# Altium project Systolic.PrjPcb
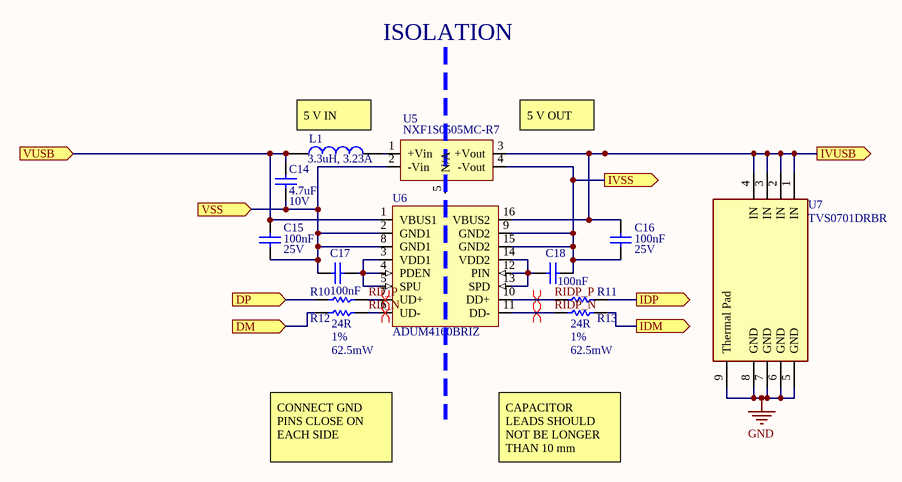
[diagram p0: USB Isolation.SchDoc]
3 sheets, 41 parts. Net scope: flat (ports and power ports of the same name join across sheets).
Board file: Systolic.PcbDoc
Sheets:
  USB Isolation.SchDoc
  ECG FRONT.SchDoc
  LDOSUPPLY.SchDoc

## Sheet USB Isolation.SchDoc
size A

### Parts
C14  value 4.7uF  Voltage Rating: 10V  [0603 CAPACITOR]  (hidden comment: LMK107BJ475KA-T)
C15  value 100nF  Voltage Rating: 25V  [0603 CAPACITOR]  (hidden comment: CGA3E2X7R1E104K080AA)
C16  value 100nF  Voltage Rating: 25V  [0603 CAPACITOR]  (hidden comment: CGA3E2X7R1E104K080AA)
C17  value 100nF  [0603 CAPACITOR]  (hidden comment: CGA3E2X7R1E104K080AA)
C18  value 100nF  [0603 CAPACITOR]  (hidden comment: CGA3E2X7R1E104K080AA)
L1  3.3uH, 3.23A  [WE-LQS_4025]
R10  MCMR04X24R0FTL  [0402 RESISTOR]  (value not drawn)
R11  MCMR04X24R0FTL  [0402 RESISTOR]  (value not drawn)
R12  Resistance: 24R  Tolerance: 1%  Power Rating: 62.5mW  [0402 RESISTOR]  (hidden comment: MCMR04X24R0FTL)
R13  Resistance: 24R  Tolerance: 1%  Power Rating: 62.5mW  [0402 RESISTOR]  (hidden comment: MCMR04X24R0FTL)
U5  NXF1S0505MC-R7  [QFN254P1524X1067X501-6N]
U6  ADUM4160BRIZ  [SOIC127P1030X265-16N]
U7  TVS0701DRBR  [FP-DRB0008A-MFG]

### Ports
DM (in), DP (in), IDM (out), IDP (out), IVSS (out), IVUSB (out), VSS (in), VUSB (in)

### Nets
GND: U7.5(GND) U7.6(GND) U7.7(GND) U7.8(GND) U7.9(Thermal_Pad)
RD_N: R12.2 U6.6(UD-)
RD_P: R10.2 U6.7(UD+)
RIDP_N: R13.1 U6.11(DD-)
RIDP_P: R11.1 U6.10(DD+)
NetC14_1: C14.1 C15.1 C17.2 U5.2(-Vin) U6.2(GND1) U6.8(GND1) ; port VSS
NetC14_2: C14.2 C15.2 L1.1 U6.1(VBUS1) ; port VUSB
NetC16_1: C16.1 C18.1 U5.4(-Vout) U6.9(GND2) U6.15(GND2) ; port IVSS
NetC16_2: C16.2 U5.3(+Vout) U6.16(VBUS2) U7.1(IN) U7.2(IN) U7.3(IN) U7.4(IN) ; port IVUSB
NetC17_1: C17.1 U6.3(VDD1) U6.4(PDEN) U6.5(SPU)
NetC18_2: C18.2 U6.12(PIN) U6.13(SPD) U6.14(VDD2)
NetL1_2: L1.2 U5.1(+Vin)
NetR10_1: R10.1 ; port DP
NetR11_2: R11.2 ; port IDP
NetR12_1: R12.1 ; port DM
NetR13_2: R13.2 ; port IDM

Not connected (* = marked no-connect by the designer): U5 5(N/A)

### Layout directives
differential pair; differential pair class USB: RD_N, RD_P, RIDP_N, RIDP_P

### Notes on the sheet
- ISOLATION
- 5 V IN
- (near U5) 5 V OUT
- CONNECT GND PINS CLOSE ON EACH SIDE
- CAPACITOR LEADS SHOULD NOT BE LONGER THAN 10 mm

### Library data of the parts
C14 = CMP-001-00085-5: Cap Ceramic 4.7uF 10V X5R 10% SMD 0603 85°C; Case Code (Imperial): 0603; Number of Pins: 2; Dielectric: X5R; Dielectric Material: Ceramic; Contact Plating: Nickel; REACH SVHC: Unknown; Package Quantity: 1; Width: 0.031inch; Lead Free: Lead Free; Min Operating Temperature: -55°C; Packaging: Tape and Reel; Height: 0.8mm; Case Code (Metric): 1608; Length: 1.6mm; Tolerance: 10%; Case/Package: 0603; Max Operating Temperature: 85°C; Radiation Hardening: No; Mount: Surface Mount; Voltage Rating (DC): 10V; Depth: 0.8mm; Halogen Free: Halogen Free; Termination: SMD/SMT; Thickness: 0.035inch
C15-C18 = CMP-001-00083-5: Cap Ceramic 0.1uF 25V X7R 10% SMD 0603 125°C; Max Operating Temperature: 125°C; Mount: Surface Mount; Thickness: 0.035inch; Composition: Ceramic; Lead Free: Lead Free; Case/Package: 0603; Packaging: Tape and Reel; Ratings: AEC-Q200; Min Operating Temperature: -55°C; Weight: 7.1E-05oz; Width: 0.031inch; Termination: SMD/SMT; Tolerance: 10%; Package Quantity: 1; REACH SVHC: No SVHC; Dielectric: X7R; Voltage Rating (DC): 25V; Case Code (Imperial): 0603; Height: 0.8mm; Case Code (Metric): 1608; Depth: 0.8mm; Length: 1.6mm
  C17 C18: Voltage Rating: 25V
L1 = 74404043033A: WE-LQS SMT Power Inductor, size 4025, 3.3uH, 3.23A; Manufacturer: Wurth Elektronik; Saturation Current: 1.75A; Self Resonant Frequency: 75MHz; DC Resistance: 33mOhm; ComponentLink1Description: Manufacturer; ComponentLink1URL: http://www.we-online.de; ComponentLink2Description: Datasheet; ComponentLink2URL: https://www.we-online.com/catalog/datasheet/74404043033A.pdf; Published Date: May 2020; Rated Current: 3.23A; Operating Temperature: -40 to +125degC; Mounting Technology: SMT; Packaging: Tape and Reel; Manufacturer Part Number: 74404043033A; Inductance: 3.3uH; Size: 4025
R10 R11 = CMP-009-00178-9: MULTICOMP - MCMR04X24R0FTL - RES, CERAMIC 24R, 1%, 0.063W, 0402; Power Rating: 62.5mW; Voltage Rating (DC): 50V; Temperature Coefficient: 100ppm/°C; Resistance: 24R; Tolerance: 1%; REACH SVHC: No SVHC; Case/Package: 0402; Packaging: Cut Tape; Voltage Rating: 50V; Case Code (Metric): 1005; Composition: Ceramic; Case Code (Imperial): 0402
R12 R13 = CMP-009-00178-9: MULTICOMP - MCMR04X24R0FTL - RES, CERAMIC 24R, 1%, 0.063W, 0402; Voltage Rating (DC): 50V; Temperature Coefficient: 100ppm/°C; REACH SVHC: No SVHC; Case/Package: 0402; Packaging: Cut Tape; Voltage Rating: 50V; Case Code (Metric): 1005; Composition: Ceramic; Case Code (Imperial): 0402
U5 = CMP-019-00050-4: Module Dc-dc 5 Vin 1-OUT 5V 0.2A 1W 5-PIN SMD T/r
U6 = CMP-019-00049-3: ANALOG DEVICES   ADUM4160BRIZ   Digital Isolator, 1, 60 ns, 3.1 V, 5.5 V, SOIC, 16 Pins; Isolated Power: No; Number of Channels: 2; Min Supply Voltage: 3.1V; Propagation Delay: 70ns; Max Supply Voltage: 5.5V; Rise Time: 20ns; Channel Type: Bidirectional; Nominal Supply Current: 6mA; Data Rate: 12Mbps; Max Input Current: 8mA; Turn-On Delay Time: 60ns; Depth: 2.65mm; Contact Plating: Tin,Matte; REACH SVHC: No SVHC; Min Operating Temperature: -40°C; Lead Free: Contains Lead; Number of Pins: 16; Packaging: Rail/Tube; Case/Package: SOIC; Length: 10.5mm; Package Quantity: 37; Max Operating Temperature: 105°C; Width: 7.6mm
U7 = CMP-04985-000001-1: TVS ARRAYS; Manufacturer: Texas instruments; Capacitance: 77pF; Peak Pulse Current: 30A; Standoff Height: 0mm; Direction: Bidirectional; Number Of Channels: 1; Breakdown Voltage: 9.3V; Reverse Standoff Voltage: 7V; Value: 77pF; Clamping Voltage: 11V; Temperature Range Low: -40°C; Category: IC; Lead Free: Yes; Device Class L2: ESD and Circuit Protection ICs; Ambient Temperature Range High: +125°C; RoHS: TRUE; Manufacturer Part Number: TVS0701DRBR; Device Class L3: unset; Ambient Temperature Range Low: -40°C; Mouser Description: 7-V bidirectional flat-clamp surge protection device 8-SON -40 to 125; Height: 1mm; Octopart: https://octopart.com/tvs0701drbr-texas+instruments-96189204; Automotive: No; Temperature: -40°C to +125°C; ComponentLink2URL: http://www.ti.com/lit/ds/symlink/tvs0701.pdf; Device Class L1: Circuit Protection; Package: DRB0008A; Digikey Description: TVS ARRAYS; Temperature Range High: +125°C; ComponentLink2Description: Datasheet

## Sheet ECG FRONT.SchDoc
size A
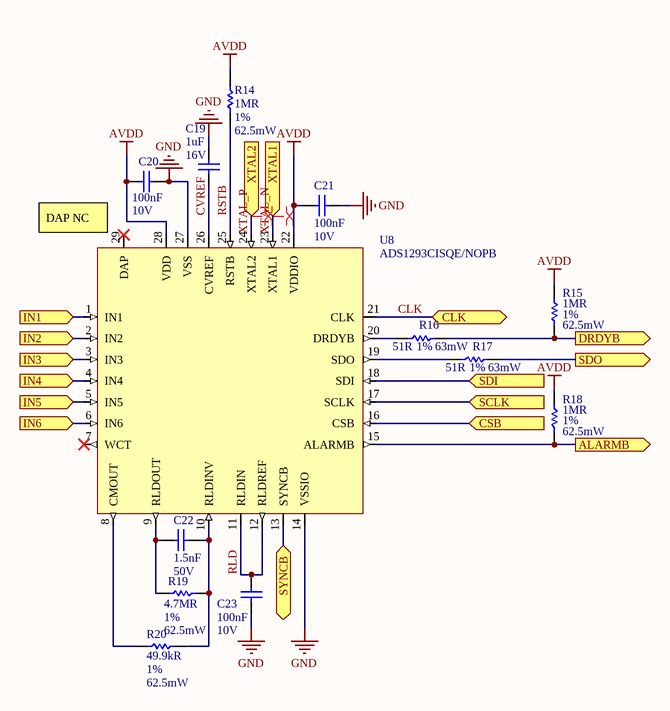
[diagram p1: ECG FRONT.SchDoc]

### Parts
C19  Voltage Rating: 16V  Capacitance: 1uF  [0402 CAPACITOR]  (hidden comment: EMK105BJ105KV-F)
C20  Capacitance: 100nF  Voltage Rating: 10V  [0402 CAPACITOR]  (hidden comment: C0402C104K8PACTU)
C21  Capacitance: 100nF  Voltage Rating: 10V  [0402 CAPACITOR]  (hidden comment: C0402C104K8PACTU)
C22  Capacitance: 1.5nF  Voltage Rating: 50V  [0402 CAPACITOR]  (hidden comment: 0402B152J500CT)
C23  Capacitance: 100nF  Voltage Rating: 10V  [0402 CAPACITOR]  (hidden comment: C0402C104K8PACTU)
R14  Resistance: 1MR  Tolerance: 1%  Power Rating: 62.5mW  [0402 RESISTOR]  (hidden comment: MCWR04X1004FTL)
R15  Resistance: 1MR  Tolerance: 1%  Power Rating: 62.5mW  [0402 RESISTOR]  (hidden comment: MCWR04X1004FTL)
R16  Resistance: 51R  Tolerance: 1%  Power Rating: 63mW  [0402 RESISTOR]  (hidden comment: CRCW040251R0FKED)
R17  Resistance: 51R  Tolerance: 1%  Power Rating: 63mW  [0402 RESISTOR]  (hidden comment: CRCW040251R0FKED)
R18  Resistance: 1MR  Tolerance: 1%  Power Rating: 62.5mW  [0402 RESISTOR]  (hidden comment: MCWR04X1004FTL)
R19  Resistance: 4.7MR  Tolerance: 1%  Power Rating: 62.5mW  [0402 RESISTOR]  (hidden comment: MCWR04W4704FTL)
R20  Resistance: 49.9kR  Tolerance: 1%  Power Rating: 62.5mW  [0402 RESISTOR]  (hidden comment: MCWR04X4992FTL)
U8  ADS1293CISQE/NOPB  [QFN50P500X500X80_HS-29N]

### Ports
ALARMB (out), CLK (bidir), CSB (in), DRDYB (out), IN1 (in), IN2 (in), IN3 (in), IN4 (in), IN5 (in), IN6 (in), SCLK (in), SDI (in), SDO (out), SYNCB (bidir), XTAL1 (in), XTAL2 (in)

### Nets
AVDD: C20.1 C21.1 R14.2 R15.2 R18.2 U8.22(VDDIO) U8.28(VDD)
GND: C19.2 C20.2 C21.2 C23.2 U8.14(VSSIO) U8.27(VSS)
CLK: U8.21(CLK) ; port CLK
CVREF: C19.1 U8.26(CVREF)
RLD: C23.1 U8.11(RLDIN) U8.12(RLDREF)
RSTB: R14.1 U8.25(RSTB)
XTAL_N: U8.23(XTAL1) ; port XTAL1
XTAL_P: U8.24(XTAL2) ; port XTAL2
NetC22_1: C22.1 R19.1 R20.1 U8.10(RLDINV)
NetC22_2: C22.2 R19.2 U8.9(RLDOUT)
NetC25_2: U8.1(IN1) ; port IN1
NetC27_2: U8.2(IN2) ; port IN2
NetR15_1: R15.1 R16.2 ; port DRDYB
NetR16_1: R16.1 U8.20(DRDYB)
NetR17_1: R17.1 U8.19(SDO)
NetR17_2: R17.2 ; port SDO
NetR18_1: R18.1 U8.15(ALARMB) ; port ALARMB
NetR20_2: R20.2 U8.8(CMOUT)
NetU8_3: U8.3(IN3) ; port IN3
NetU8_4: U8.4(IN4) ; port IN4
NetU8_5: U8.5(IN5) ; port IN5
NetU8_6: U8.6(IN6) ; port IN6
NetU8_13: U8.13(SYNCB) ; port SYNCB
NetU8_16: U8.16(CSB) ; port CSB
NetU8_17: U8.17(SCLK) ; port SCLK
NetU8_18: U8.18(SDI) ; port SDI

Not connected (* = marked no-connect by the designer): U8 7(WCT)* 29(DAP)*

### Layout directives
differential pair; differential pair class XTAL: XTAL_N, XTAL_P

### Notes on the sheet
- (near U8) DAP NC

### Library data of the parts
C19 = CMP-001-00084-6: Cap Ceramic 1uF 16V X5R 10% SMD 0402 85°C; Case Code (Metric): 1005; Thickness: 0.022inch; REACH SVHC: Unknown; Termination: SMD/SMT; Packaging: Tape and Reel; Max Operating Temperature: 85°C; Package Quantity: 1; Tolerance: 10%; Mount: Surface Mount; Number of Pins: 2; Halogen Free: Halogen Free; Height: 0.5mm; Voltage Rating (DC): 16V; Case Code (Imperial): 0402; Case/Package: 0402; Width: 0.02inch; Depth: 0.5mm; Radiation Hardening: No; Min Operating Temperature: -55°C; Length: 1mm; Dielectric: X5R
C20 C21 C23 = CMP-001-00061-5: Cap Ceramic 0.1uF 10V X5R 10% SMD 0402 85°C; Dissipation Factor: 5%; Number of Pins: 2; Case Code (Metric): 1005; Min Operating Temperature: -55°C; Thickness: 0.022inch; Radiation Hardening: No; Packaging: Tape and Reel; Depth: 0.5mm; Voltage: 10V; Lead Pitch: 0.3mm; Voltage Rating (DC): 10V; Mount: Surface Mount,PCB; Max Operating Temperature: 85°C; Termination: SMD/SMT; Case Code (Imperial): 0402; Width: 0.02inch; REACH SVHC: No SVHC; Contact Plating: Tin,Matte; Length: 1mm; Package Quantity: 1; Dielectric: X5R; Tolerance: 10%; Lead Free: Lead Free; Dielectric Material: Ceramic; Case/Package: 0402; Height: 0.5mm
C22 = CMP-001-00089-2: Cap Ceramic 1.5nF 50V X7R 5% SMD 0402 125°C; Packaging: Tape and Reel; Max Operating Temperature: 125°C; Case Code (Metric): 1005; Length: 1mm; Voltage Rating (DC): 50V; Tolerance: 5%; Min Operating Temperature: -55°C; REACH SVHC: Unknown; Case Code (Imperial): 0402; Dielectric: X7R; Depth: 0.5mm; Case/Package: 0402
R14 R15 R18 = CMP-009-00177-1: 1MR 0402; Voltage Rating (DC): 50V; Temperature Coefficient: 100ppm/°C; Case Code (Metric): 1005; Case/Package: 0402; Voltage Rating: 50V; Mount: Surface Mount; Packaging: Cut Tape; REACH SVHC: No SVHC; Composition: Thick Film; Case Code (Imperial): 0402
R16 R17 = CMP-009-00186-1: 51R 0402 AEC-Q200; Voltage Rating (DC): 50V; Temperature Coefficient: 100ppm/°C; Lead Free: Lead Free; REACH SVHC: Unknown; Package Quantity: 10; Case Code (Imperial): 0402; Case Code (Metric): 1005; Military Standard: Not; Length: 1mm; Width: 0.5mm; Number of Terminations: 2; Voltage Rating: 50V; Weight: 2.3E-05oz; Case/Package: 0402; Max Operating Temperature: 155°C; Max Power Dissipation: 63mW; Termination: SMD/SMT; Depth: 0.5mm; Packaging: Tape and Reel; Features: Automotive AEC-Q200; Min Operating Temperature: -55°C; Composition: Thick Film; Radiation Hardening: No; Number of Pins: 2; Height: 0.35mm; Contact Plating: Tin
R19 = CMP-009-00181-1: Res Thick FIlm 4.7MR 50V 1% SMD 0402; Temperature Coefficient: 100ppm/°C; REACH SVHC: No SVHC; Voltage Rating: 50V; Voltage Rating (DC): 50V; Case/Package: 0402; Case Code (Metric): 1005; Packaging: Cut Tape; Mount: Surface Mount; Case Code (Imperial): 0402; Composition: Thick Film
R20 = CMP-009-00182-1: Res Thick FIlm 49.9kR 50V 1% SMD 0402; Temperature Coefficient: 100ppm/°C; Packaging: Cut Tape; Composition: Thick Film; Voltage Rating: 50V; Case/Package: 0402; REACH SVHC: No SVHC; Voltage Rating (DC): 50V; Case Code (Imperial): 0402; Case Code (Metric): 1005
U8 = CMP-014-00002-4: AFE General Purpose 3ADC 24-Bit 3.3V/5V 28-Pin LLP EP T/R; Operating Supply Current: 825uA; Number of Channels: 3; Resolution: 24b; Max Supply Voltage: 5.5V; Interface: SPI; Signal to Noise Ratio (SNR): 110dB; Min Supply Voltage: 2.7V; Conversion Rate: 25.6KS/s; Number of Bits: 24; Sampling Rate: 25KS/s; REACH SVHC: No SVHC; Length: 5mm; Max Operating Temperature: 85°C; Radiation Hardening: No; Type: General Purpose; Number of Pins: 28; Height: 0.8mm; Mount: Surface Mount; Min Operating Temperature: -20°C; Lead Free: Lead Free; Width: 5mm; Number of A/D Converters: 3; Packaging: Tape and Reel; Number of Converters: 3; Number of Inputs: 3

## Sheet LDOSUPPLY.SchDoc
size A
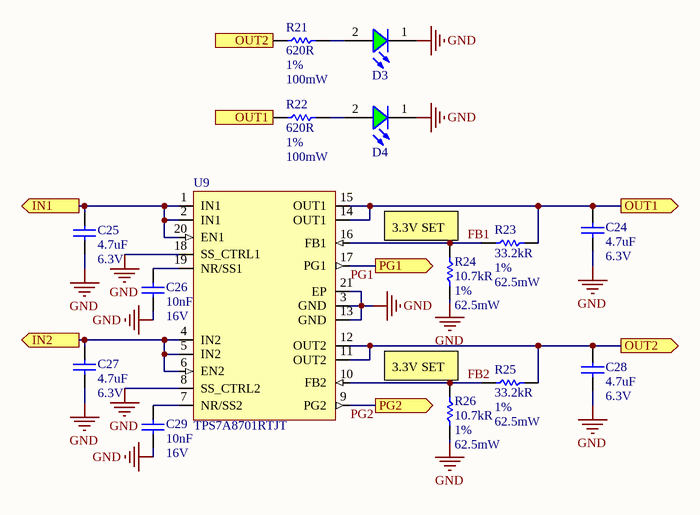
[diagram p2: LDOSUPPLY.SchDoc]

### Parts
C24  Capacitance: 4.7uF  Voltage Rating: 6.3V  [0402 CAPACITOR]  (hidden comment: CL10A475KQ8NNNC)
C25  Capacitance: 4.7uF  Voltage Rating: 6.3V  [0402 CAPACITOR]  (hidden comment: CL10A475KQ8NNNC)
C26  Capacitance: 10nF  Voltage Rating: 16V  [0402 CAPACITOR]  (hidden comment: MC0402B103J160CT)
C27  Capacitance: 4.7uF  Voltage Rating: 6.3V  [0402 CAPACITOR]  (hidden comment: CL10A475KQ8NNNC)
C28  Capacitance: 4.7uF  Voltage Rating: 6.3V  [0402 CAPACITOR]  (hidden comment: CL10A475KQ8NNNC)
C29  Capacitance: 10nF  Voltage Rating: 16V  [0402 CAPACITOR]  (hidden comment: MC0402B103J160CT)
D3  150060VS73220  [WL-SMCC_0603_RS_VS_YS]  (value not drawn)
D4  150060VS73220  [WL-SMCC_0603_RS_VS_YS]  (value not drawn)
R21  Resistance: 620R  Tolerance: 1%  Power Rating: 100mW  [0603 RESISTOR]  (hidden comment: MCMR06X6200FTL)
R22  Resistance: 620R  Tolerance: 1%  Power Rating: 100mW  [0603 RESISTOR]  (hidden comment: MCMR06X6200FTL)
R23  Resistance: 33.2kR  Tolerance: 1%  Power Rating: 62.5mW  [0402 RESISTOR]  (hidden comment: MCWR04X3322FTL)
R24  Resistance: 10.7kR  Tolerance: 1%  Power Rating: 62.5mW  [0402 RESISTOR]  (hidden comment: MCWR04X1072FTL)
R25  Resistance: 33.2kR  Tolerance: 1%  Power Rating: 62.5mW  [0402 RESISTOR]  (hidden comment: MCWR04X3322FTL)
R26  Resistance: 10.7kR  Tolerance: 1%  Power Rating: 62.5mW  [0402 RESISTOR]  (hidden comment: MCWR04X1072FTL)
U9  TPS7A8701RTJT  [QFN50P400X400X80_HS-21N]

### Ports
IN1 (out), IN2 (out), OUT1 (out), OUT2 (out), PG1 (out), PG2 (out)

### Nets
GND: C24.1 C25.1 C26.1 C27.1 C28.1 C29.1 D3.1(K) D4.1(K) R24.1 R26.1 U9.3(GND) U9.8(SS_CTRL2) U9.13(GND) U9.18(SS_CTRL1) U9.21(EP)
FB1: R23.2 R24.2 U9.16(FB1)
FB2: R25.2 R26.2 U9.10(FB2)
PG1: U9.17(PG1) ; port PG1
PG2: U9.9(PG2) ; port PG2
NetC24_2: C24.2 R22.2 R23.1 U9.14(OUT1) U9.15(OUT1) ; port OUT1
NetC25_2: C25.2 U9.1(IN1) U9.2(IN1) U9.20(EN1) ; port IN1
NetC26_2: C26.2 U9.19(NR/SS1)
NetC27_2: C27.2 U9.4(IN2) U9.5(IN2) U9.6(EN2) ; port IN2
NetC28_2: C28.2 R21.2 R25.1 U9.11(OUT2) U9.12(OUT2) ; port OUT2
NetC29_2: C29.2 U9.7(NR/SS2)
NetD3_2: D3.2(A) R21.1
NetD4_2: D4.2(A) R22.1

### Notes on the sheet
- (near R24) 3.3V SET
- (near R26) 3.3V SET

### Library data of the parts
C24 C25 C27 C28 = CMP-001-00091-2: Cap Ceramic 4.7uF 6.3V X5R 10% SMD 0402 85°C; Max Operating Temperature: 85°C; Radiation Hardening: No; Voltage: 6.3V; Case Code (Metric): 1608; Case/Package: 0603; Tolerance: 10%; Dielectric: X5R; Mount: Surface Mount; Packaging: Tape and Reel; Height: 0.8mm; Thickness: 0.035inch; Length: 1.6mm; Contact Plating: Tin; Package Quantity: 1; Depth: 0.8mm; Min Operating Temperature: -55°C; Width: 0.031inch; Material: Ceramic; Case Code (Imperial): 0603
C26 C29 = CMP-001-00090-2: Cap Ceramic 10nF 16V X7R 5% SMD 0402 125°C; Case Code (Imperial): 0402; Case Code (Metric): 1005; Packaging: Tape and Reel; Min Operating Temperature: -55°C; Voltage Rating (DC): 16V; Case/Package: 0402; Dielectric: X7R; REACH SVHC: Unknown; Tolerance: 5%; Max Operating Temperature: 125°C
D3 D4 = 150060VS73220: WL-SMCC SMD Mono-color Chip LED Compact, size 0603, Bright Green, 2V, 120deg; Dominant Wavelength: 573nm; Luminous Intensity: 60mcd; Peak Wavelength: 575nm; Chip Technology: AlInGaP; ComponentLink1URL: http://www.we-online.de; ComponentLink2Description: Datasheet; ComponentLink2URL: https://katalog.we-online.com/led/datasheet/150060VS73220.pdf; Part Number: 150060VS73220; Published Date: July 2019; Publisher: Wurth Elektronik; Size: 0603; Viewing Angle: 120deg; Packaging: Tape and Reel; Emitting Color: Bright Green; Mounting Technology: SMT; Forward Voltage: 2V; Operating Temperature: -40 to +85degC
R21 R22 = CMP-009-00202-2: RES, CERAMIC, 620R, 1%, 0.1W, 0603; Temperature Coefficient: 100ppm/°C; Voltage Rating: 75V; Case/Package: 0603; Case Code (Metric): 1608; Packaging: Cut Tape; REACH SVHC: No SVHC; Case Code (Imperial): 0603; Composition: Ceramic; Voltage Rating (DC): 75V
R23 R25 = CMP-009-00187-1: MULTICOMP - MCMR04X24R0FTL - RES, CERAMIC 33.2kR, 1%, 0.063W, 0402; Voltage Rating (DC): 50V; Temperature Coefficient: 100ppm/°C; Voltage Rating: 50V; Case Code (Imperial): 0402; Composition: Ceramic; Case Code (Metric): 1005; Packaging: Cut Tape; REACH SVHC: No SVHC; Case/Package: 0402
R24 R26 = CMP-009-00185-1: MULTICOMP - MCMR04X24R0FTL - RES, CERAMIC 10.7kR, 1%, 0.063W, 0402; Voltage Rating (DC): 50V; Temperature Coefficient: 100ppm/°C; Case Code (Metric): 1005; Composition: Ceramic; REACH SVHC: No SVHC; Case Code (Imperial): 0402; Packaging: Cut Tape; Voltage Rating: 50V; Case/Package: 0402
U9 = CMP-019-00051-1: IC REG LIN POS ADJ 500MA 20QFN; Min Input Voltage: 1.4V; Dropout Voltage: 100mV; Quiescent Current: 2.1mA; Voltage - Output 2: 5.2V; Number of Outputs: 2; Max Input Voltage: 6.5V; Packaging: Cut Tape; Lead Free: Lead Free; Current - Output 2: 500mA; REACH SVHC: No SVHC; Voltage - Output 1: 5.2V; Number of Pins: 20; Current - Output 1: 500mA; Min Operating Temperature: -40°C; Max Operating Temperature: 125°C

## Nets that join several sheets
GND: USB Isolation (5 pins), ECG FRONT (6 pins), LDOSUPPLY (15 pins)
NetC25_2: ECG FRONT (U8.1), LDOSUPPLY (C25.2 U9.1 U9.2 U9.20)
NetC27_2: ECG FRONT (U8.2), LDOSUPPLY (C27.2 U9.4 U9.5 U9.6)